# EAGLE design LED_CUBE_595 (EAGLE 7.5.0)
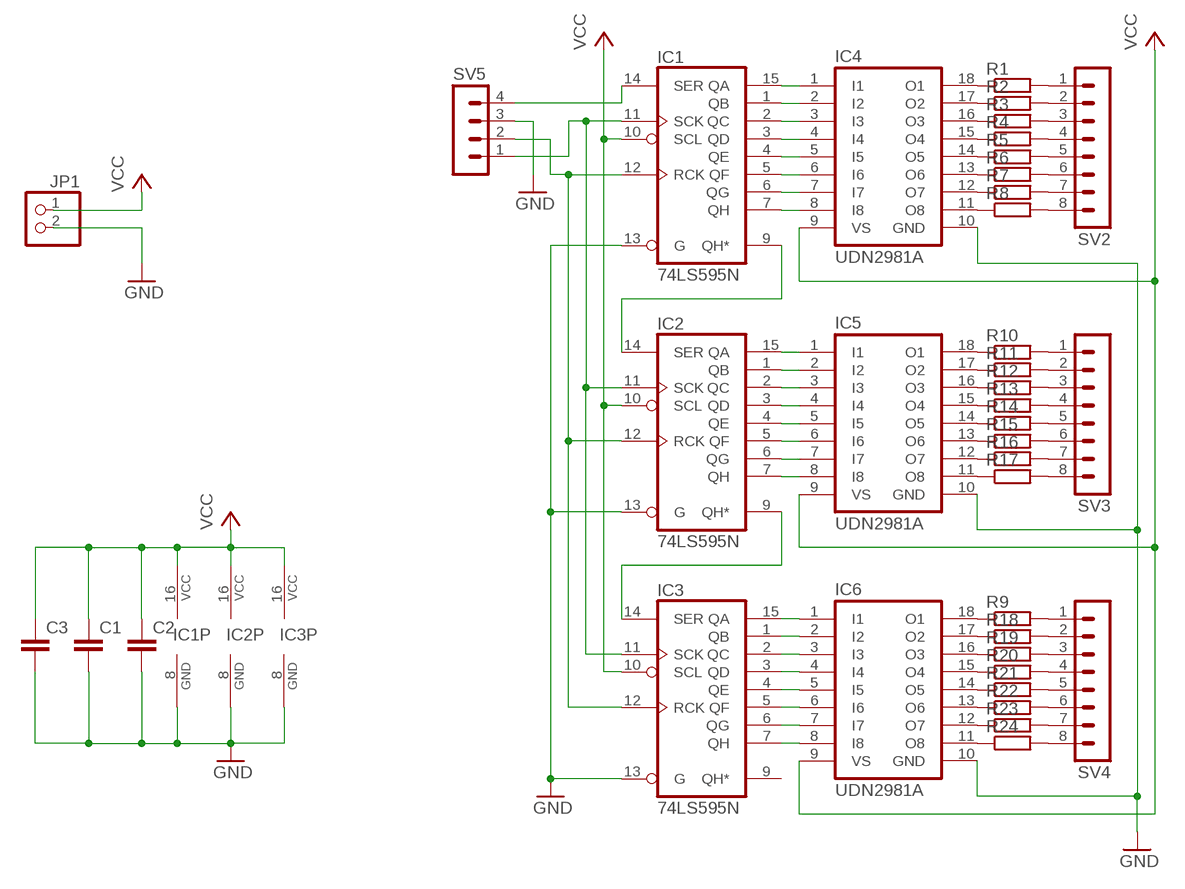
[diagram p0: schematic, sheet 1]

## Parts
C1  C-EU025-025X050  [C025-025X050]
C2  C-EU025-025X050  [C025-025X050]
C3  C-EU025-025X050  [C025-025X050]
IC1  74LS595N  [DIL16]
IC2  74LS595N  [DIL16]
IC3  74LS595N  [DIL16]
IC4  UDN2981A  [DIL18]
IC5  UDN2981A  [DIL18]
IC6  UDN2981A  [DIL18]
JP1  PINHD-1X2  [1X02]
R1  R-EU_0204/2V  [0204V]
R2  R-EU_0204/2V  [0204V]
R3  R-EU_0204/2V  [0204V]
R4  R-EU_0204/2V  [0204V]
R5  R-EU_0204/2V  [0204V]
R6  R-EU_0204/2V  [0204V]
R7  R-EU_0204/2V  [0204V]
R8  R-EU_0204/2V  [0204V]
R9  R-EU_0204/2V  [0204V]
R10  R-EU_0204/2V  [0204V]
R11  R-EU_0204/2V  [0204V]
R12  R-EU_0204/2V  [0204V]
R13  R-EU_0204/2V  [0204V]
R14  R-EU_0204/2V  [0204V]
R15  R-EU_0204/2V  [0204V]
R16  R-EU_0204/2V  [0204V]
R17  R-EU_0204/2V  [0204V]
R18  R-EU_0204/2V  [0204V]
R19  R-EU_0204/2V  [0204V]
R20  R-EU_0204/2V  [0204V]
R21  R-EU_0204/2V  [0204V]
R22  R-EU_0204/2V  [0204V]
R23  R-EU_0204/2V  [0204V]
R24  R-EU_0204/2V  [0204V]
SV2  MA08-1  [MA08-1]
SV3  MA08-1  [MA08-1]
SV4  MA08-1  [MA08-1]
SV5  MA04-1  [MA04-1]

## Nets
GND: C1.2 C2.2 C3.2 IC1.8(GND) IC1.13(G) IC2.8(GND) IC2.13(G) IC3.8(GND) IC3.13(G) IC4.10(GND) IC5.10(GND) IC6.10(GND) JP1.2 SV5.3
N$1: IC1.9(QH*) IC2.14(SER)
N$2: IC1.15(QA) IC4.1(I1)
N$3: IC1.1(QB) IC4.2(I2)
N$4: IC1.2(QC) IC4.3(I3)
N$5: IC1.3(QD) IC4.4(I4)
N$6: IC1.4(QE) IC4.5(I5)
N$7: IC1.5(QF) IC4.6(I6)
N$8: IC1.6(QG) IC4.7(I7)
N$9: IC1.7(QH) IC4.8(I8)
N$10: IC2.15(QA) IC5.1(I1)
N$11: IC2.1(QB) IC5.2(I2)
N$12: IC2.2(QC) IC5.3(I3)
N$13: IC2.3(QD) IC5.4(I4)
N$14: IC2.4(QE) IC5.5(I5)
N$15: IC2.5(QF) IC5.6(I6)
N$16: IC2.6(QG) IC5.7(I7)
N$17: IC2.7(QH) IC5.8(I8)
N$18: IC4.18(O1) R1.1
N$19: IC4.17(O2) R2.1
N$20: IC4.16(O3) R3.1
N$21: IC4.15(O4) R4.1
N$22: IC4.14(O5) R5.1
N$23: IC4.13(O6) R6.1
N$24: IC4.12(O7) R7.1
N$25: IC4.11(O8) R8.1
N$26: R1.2 SV2.1
N$27: IC1.11(SCK) IC2.11(SCK) IC3.11(SCK) SV5.1
N$28: IC1.14(SER) SV5.4
N$29: IC1.12(RCK) IC2.12(RCK) IC3.12(RCK) SV5.2
N$30: IC2.9(QH*) IC3.14(SER)
N$32: IC5.17(O2) R11.1
N$33: IC5.16(O3) R12.1
N$34: IC5.15(O4) R13.1
N$35: IC5.14(O5) R14.1
N$36: IC5.13(O6) R15.1
N$37: IC5.12(O7) R16.1
N$38: IC5.11(O8) R17.1
N$39: R2.2 SV2.2
N$40: IC5.18(O1) R10.1
N$41: R3.2 SV2.3
N$42: R4.2 SV2.4
N$43: R5.2 SV2.5
N$44: R6.2 SV2.6
N$45: R7.2 SV2.7
N$46: R8.2 SV2.8
N$47: R10.2 SV3.1
N$48: R11.2 SV3.2
N$49: R12.2 SV3.3
N$50: R13.2 SV3.4
N$51: R14.2 SV3.5
N$52: R15.2 SV3.6
N$53: R16.2 SV3.7
N$54: R17.2 SV3.8
N$55: IC6.18(O1) R9.1
N$56: IC6.17(O2) R18.1
N$57: IC6.16(O3) R19.1
N$58: IC6.15(O4) R20.1
N$59: IC6.14(O5) R21.1
N$60: IC6.13(O6) R22.1
N$61: IC6.12(O7) R23.1
N$62: IC6.11(O8) R24.1
N$63: R9.2 SV4.1
N$64: R18.2 SV4.2
N$65: R19.2 SV4.3
N$66: R20.2 SV4.4
N$67: R21.2 SV4.5
N$68: R22.2 SV4.6
N$69: R23.2 SV4.7
N$70: R24.2 SV4.8
N$73: IC3.15(QA) IC6.1(I1)
N$74: IC3.1(QB) IC6.2(I2)
N$75: IC3.2(QC) IC6.3(I3)
N$76: IC3.3(QD) IC6.4(I4)
N$77: IC3.4(QE) IC6.5(I5)
N$78: IC3.5(QF) IC6.6(I6)
N$79: IC3.6(QG) IC6.7(I7)
N$80: IC3.7(QH) IC6.8(I8)
VCC: C1.1 C2.1 C3.1 IC1.10(SCL) IC1.16(VCC) IC2.10(SCL) IC2.16(VCC) IC3.10(SCL) IC3.16(VCC) IC4.9(VS) IC5.9(VS) IC6.9(VS) JP1.1
Unconnected: IC3.9(QH*)

## Library data of the parts
C1-C3 = rcl:C-EU: CAPACITOR, European symbol
IC1-IC3 = 74xx-us:74*595: 8-bit SHIFT REGISTER, output latch
IC4-IC6 = uln-udn:UDN298*: DRIVER ARRAY Source: Allegro Microsystems Inc. / UDN2981-UDN2984.pdf
JP1 = pinhead:PINHD-1X2: PIN HEADER
R1-R24 = rcl:R-EU_: RESISTOR, European symbol
SV2-SV4 = con-lstb:MA08-1: PIN HEADER; OC_FARNELL: unknown; OC_NEWARK: unknown
SV5 = con-lstb:MA04-1: PIN HEADER; OC_FARNELL: unknown; OC_NEWARK: unknown

## Board
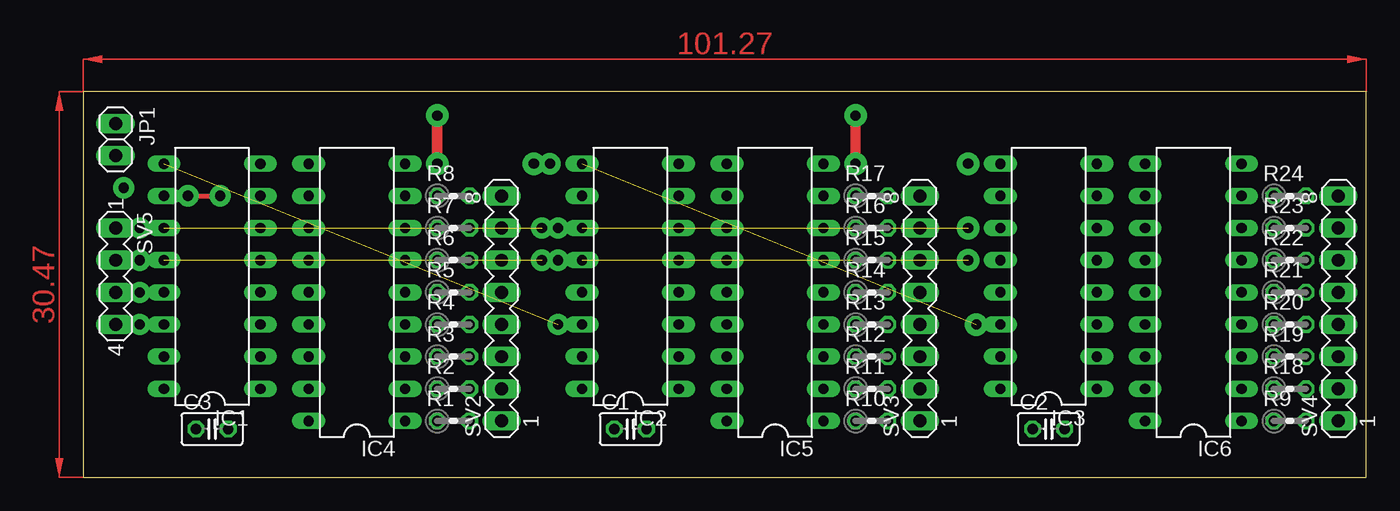
[diagram p1: board, top side]
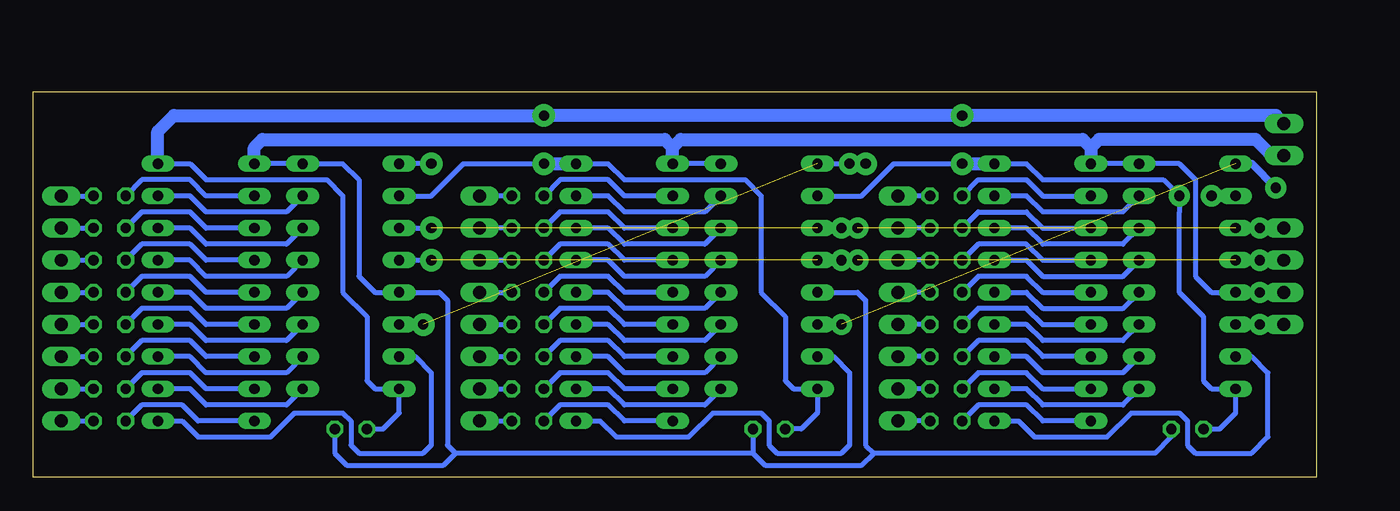
[diagram p2: board, bottom side, seen from below]

Size 101.27 x 30.47 mm. Coordinates in mm from the lower left corner, seen from the top.
Outline: 0,0 101.27,0 101.27,30.47 0,30.47 0,0
Copper layers (1*16): Top 0.035mm / dielectric 1.5mm / Bottom 0.035mm
Design rules "default": minimum track width 10mil, minimum drill 24mil, track to track 8mil, track to pad 8mil, pad to pad 8mil, via to via 8mil, smd to smd 8mil, copper to edge 40mil, drill to drill 8mil, minimum pad ring 10mil, minimum via ring 8mil, stop-mask expansion 4mil, vias tented up to drill 0mil, thermal gap 10mil

### Footprints (pad centres in the part's own frame; a part is rotated, then mirrored left to right if it is on the bottom)
C025-025X050 = drill 0.813 octagon: 1 -1.27,0; 2 1.27,0
DIL16 = drill 0.813 long: 1 -8.89,-3.81; 2 -6.35,-3.81; 3 -3.81,-3.81; 4 -1.27,-3.81; 5 1.27,-3.81; 6 3.81,-3.81; 7 6.35,-3.81; 8 8.89,-3.81; 9 8.89,3.81; 10 6.35,3.81; 11 3.81,3.81; 12 1.27,3.81; 13 -1.27,3.81; 14 -3.81,3.81; 15 -6.35,3.81; 16 -8.89,3.81
DIL18 = drill 0.813 long: 1 -10.16,-3.81; 2 -7.62,-3.81; 3 -5.08,-3.81; 4 -2.54,-3.81; 5 0,-3.81; 6 2.54,-3.81; 7 5.08,-3.81; 8 7.62,-3.81; 9 10.16,-3.81; 10 10.16,3.81; 11 7.62,3.81; 12 5.08,3.81; 13 2.54,3.81; 14 0,3.81; 15 -2.54,3.81; 16 -5.08,3.81; 17 -7.62,3.81; 18 -10.16,3.81
1X02 = drill 1.016 long: 1 -1.27,0; 2 1.27,0
0204V = drill 0.813 octagon: 1 -1.27,0; 2 1.27,0
MA08-1 = drill 1.016 long: 1 -8.89,0; 2 -6.35,0; 3 -3.81,0; 4 -1.27,0; 5 1.27,0; 6 3.81,0; 7 6.35,0; 8 8.89,0
MA04-1 = drill 1.016 long: 1 -3.81,0; 2 -1.27,0; 3 1.27,0; 4 3.81,0

### Placement (x,y rotation side)
C1  43.18,3.81 0 top
C2  76.2,3.81 0 top
C3  10.16,3.81 0 top
IC1  10.16,15.88 90 top
IC2  43.18,15.88 90 top
IC3  76.2,15.88 90 top
IC4  21.59,14.61 90 top
IC5  54.61,14.61 90 top
IC6  87.63,14.61 90 top
JP1  2.54,26.67 270 top
R1  29.21,4.45 0 top
R2  29.21,6.99 0 top
R3  29.21,9.53 0 top
R4  29.21,12.06 0 top
R5  29.21,14.61 0 top
R6  29.21,17.14 0 top
R7  29.21,19.68 0 top
R8  29.21,22.23 0 top
R9  95.25,4.45 0 top
R10  62.23,4.45 0 top
R11  62.23,6.99 0 top
R12  62.23,9.53 0 top
R13  62.23,12.06 0 top
R14  62.23,14.61 0 top
R15  62.23,17.14 0 top
R16  62.23,19.68 0 top
R17  62.23,22.23 0 top
R18  95.25,6.99 0 top
R19  95.25,9.53 0 top
R20  95.25,12.06 0 top
R21  95.25,14.61 0 top
R22  95.25,17.14 0 top
R23  95.25,19.68 0 top
R24  95.25,22.23 0 top
SV2  33.02,13.34 90 top
SV3  66.04,13.34 90 top
SV4  99.06,13.34 90 top
SV5  2.54,15.88 270 top

### Tracks (layer width: path | path; a pad name or v marks a point on that pad's centre or on a via)
GND
  Bottom 0.406: IC4.10 IC1.8 10.79,24.77 9.53,23.5 9.53,15.88 8.26,14.61 IC1.13 SV5.3 | IC2.8 IC5.10 | IC6.10 IC3.8 76.84,24.77 75.57,23.5 75.57,15.88 74.3,14.61 IC3.13 69.22,14.61 68.58,13.97 68.58,2.54 67.95,1.91 | IC2.13 36.2,14.61 35.56,13.97 35.56,2.54 34.92,1.91 | 44.45,1.91 67.95,1.91 | 34.92,1.91 12.7,1.91 11.43,3.17 C3.2 | C1.2 44.45,1.91 | C2.2 77.47,1.91 76.52,0.95 68.9,0.95 67.95,1.91 | 44.45,1.91 43.5,0.95 35.88,0.95 34.92,1.91
  Bottom 1.016: IC5.10 50.8,26.04 | 17.78,26.04 IC4.10 | 17.78,26.04 17.15,26.67 4.76,26.67 3.49,25.4 JP1.2 | 50.8,26.04 50.16,26.67 18.42,26.67 17.78,26.04 | IC6.10 83.82,26.04 83.19,26.67 51.43,26.67 50.8,26.04
N$1  (via drill 0.8 pad 1.68)  (1 unrouted)
  Bottom 0.406: IC2.14 v37.46,12.06
  Bottom 0.61: IC1.9 5.08,24.77 v3.17,22.86
  other vias: 4.45,19.68 4.45,17.14 4.45,14.61 4.45,12.06
N$2
  Bottom 0.406: IC4.1 23.5,4.45 22.23,3.17 16.51,3.17 14.61,5.08 10.79,5.08 10.16,4.45 10.16,2.54 9.53,1.91 5.08,1.91 3.81,3.17 3.81,8.26 5.08,9.53 IC1.15
N$3
  Bottom 0.406: IC1.1 15.24,5.71 21.59,5.71 22.86,6.99 IC4.2
N$4
  Bottom 0.406: IC1.2 15.24,8.26 21.59,8.26 22.86,9.53 IC4.3
N$5
  Bottom 0.406: IC1.3 15.24,10.79 21.59,10.79 22.86,12.06 IC4.4
N$6
  Bottom 0.406: IC4.5 22.86,14.61 21.59,13.34 15.24,13.34 IC1.4
N$7
  Bottom 0.406: IC4.6 22.86,17.14 21.59,15.88 15.24,15.88 IC1.5
N$8
  Bottom 0.406: IC1.6 15.24,18.41 21.59,18.41 22.86,19.68 IC4.7
N$9
  Bottom 0.406: IC1.7 15.24,20.95 21.59,20.95 22.86,22.23 IC4.8
N$10
  Bottom 0.406: IC5.1 56.52,4.45 55.24,3.17 49.53,3.17 47.62,5.08 43.81,5.08 43.18,4.45 43.18,2.54 42.54,1.91 37.46,1.91 36.83,2.54 36.83,8.26 38.1,9.53 IC2.15
N$11
  Bottom 0.406: IC2.1 48.26,5.71 54.61,5.71 55.88,6.99 IC5.2
N$12
  Bottom 0.406: IC2.2 48.26,8.26 54.61,8.26 55.88,9.53 IC5.3
N$13
  Bottom 0.406: IC2.3 48.26,10.79 54.61,10.79 55.88,12.06 IC5.4
N$14
  Bottom 0.406: IC2.4 48.26,13.34 54.61,13.34 55.88,14.61 IC5.5
N$15
  Bottom 0.406: IC2.5 48.26,15.88 54.61,15.88 55.88,17.14 IC5.6
N$16
  Bottom 0.406: IC2.6 48.26,18.41 54.61,18.41 55.88,19.68 IC5.7
N$17
  Bottom 0.406: IC2.7 48.26,20.95 54.61,20.95 55.88,22.23 IC5.8
N$18
  Bottom 0.406: IC4.18 21.59,4.45 22.86,5.71 26.67,5.71 R1.1
N$19
  Bottom 0.406: IC4.17 21.59,6.99 22.86,8.26 26.67,8.26 R2.1
N$20
  Bottom 0.406: IC4.16 21.59,9.53 22.86,10.79 26.67,10.79 R3.1
N$21
  Bottom 0.406: IC4.15 21.59,12.06 22.86,13.34 26.67,13.34 R4.1
N$22
  Bottom 0.406: IC4.14 21.59,14.61 22.86,15.88 26.67,15.88 R5.1
N$23
  Bottom 0.406: IC4.13 21.59,17.14 22.86,18.41 26.67,18.41 R6.1
N$24
  Bottom 0.406: R7.1 26.67,20.95 22.86,20.95 21.59,19.68 IC4.12
N$25
  Bottom 0.406: R8.1 26.67,23.5 22.86,23.5 21.59,22.23 IC4.11
N$26
  Bottom 0.406: R1.2 SV2.1
N$27  (via drill 0.8 pad 1.68, 0.8 pad 1.78)  (2 unrouted)
  Bottom 0.406: SV5.1 IC1.11 | IC3.11 v69.85,19.68 | IC2.11 v37.46,19.68 v36.2,19.68
N$28
  Bottom 0.406: SV5.4 IC1.14
N$29  (via drill 0.8 pad 1.68, 0.8 pad 1.78)  (2 unrouted)
  Bottom 0.406: SV5.2 IC1.12 | IC3.12 v69.85,17.14 | IC2.12 v37.46,17.14 v36.2,17.14
N$30  (via drill 0.8 pad 1.68, 0.8 pad 1.78)  (1 unrouted)
  Bottom 0.406: IC3.14 v70.48,12.06 | v36.83,24.77 IC2.9 35.56,24.77
N$31  (via drill 0.8 pad 1.78)
  other vias: 35.56,24.77
N$32
  Bottom 0.406: IC5.17 54.61,6.99 55.88,8.26 59.69,8.26 R11.1
N$33
  Bottom 0.406: IC5.16 54.61,9.53 55.88,10.79 59.69,10.79 R12.1
N$34
  Bottom 0.406: IC5.15 54.61,12.06 55.88,13.34 59.69,13.34 R13.1
N$35
  Bottom 0.406: IC5.14 54.61,14.61 55.88,15.88 59.69,15.88 R14.1
N$36
  Bottom 0.406: IC5.13 54.61,17.14 55.88,18.41 59.69,18.41 R15.1
N$37
  Bottom 0.406: IC5.12 54.61,19.68 55.88,20.95 59.69,20.95 R16.1
N$38
  Bottom 0.406: IC5.11 54.61,22.23 55.88,23.5 59.69,23.5 R17.1
N$39
  Bottom 0.406: R2.2 SV2.2
N$40
  Bottom 0.406: IC5.18 54.61,4.45 55.88,5.71 59.69,5.71 R10.1
N$41
  Bottom 0.406: R3.2 SV2.3
N$42
  Bottom 0.406: R4.2 SV2.4
N$43
  Bottom 0.406: R5.2 SV2.5
N$44
  Bottom 0.406: R6.2 SV2.6
N$45
  Bottom 0.406: R7.2 SV2.7
N$46
  Bottom 0.406: R8.2 SV2.8
N$47
  Bottom 0.406: SV3.1 R10.2
N$48
  Bottom 0.406: SV3.2 R11.2
N$49
  Bottom 0.406: SV3.3 R12.2
N$50
  Bottom 0.406: SV3.4 R13.2
N$51
  Bottom 0.406: SV3.5 R14.2
N$52
  Bottom 0.406: SV3.6 R15.2
N$53
  Bottom 0.406: R16.2 SV3.7
N$54
  Bottom 0.406: R17.2 SV3.8
N$55
  Bottom 0.406: IC6.18 88.27,4.45 89.54,5.71 92.71,5.71 R9.1
N$56
  Bottom 0.406: IC6.17 87.63,6.99 88.9,8.26 92.71,8.26 R18.1
N$57
  Bottom 0.406: IC6.16 87.63,9.53 88.9,10.79 92.71,10.79 R19.1
N$58
  Bottom 0.406: IC6.15 87.63,12.06 88.9,13.34 92.71,13.34 R20.1
N$59
  Bottom 0.406: IC6.14 87.63,14.61 88.9,15.88 92.71,15.88 R21.1
N$60
  Bottom 0.406: IC6.13 87.63,17.14 88.9,18.41 92.71,18.41 R22.1
N$61
  Bottom 0.406: IC6.12 87.63,19.68 88.9,20.95 92.71,20.95 R23.1
N$62
  Bottom 0.406: IC6.11 87.63,22.23 88.9,23.5 92.71,23.5 R24.1
N$63
  Bottom 0.406: SV4.1 R9.2
N$64
  Bottom 0.406: SV4.2 R18.2
N$65
  Bottom 0.406: SV4.3 R19.2
N$66
  Bottom 0.406: SV4.4 R20.2
N$67
  Bottom 0.406: SV4.5 R21.2
N$68
  Bottom 0.406: SV4.6 R22.2
N$69
  Bottom 0.406: SV4.7 R23.2
N$70
  Bottom 0.406: SV4.8 R24.2
N$71  (via drill 0.8 pad 1.78)
  Bottom 0.406: v69.85,24.77 72.39,24.77
N$73
  Bottom 0.406: IC6.1 89.54,4.45 88.27,3.17 82.55,3.17 80.65,5.08 76.84,5.08 76.2,4.45 76.2,2.54 75.57,1.91 70.48,1.91 69.85,2.54 69.85,8.26 71.12,9.53 IC3.15
N$74
  Bottom 0.406: IC3.1 81.28,5.71 87.63,5.71 88.9,6.99 IC6.2
N$75
  Bottom 0.406: IC3.2 81.28,8.26 87.63,8.26 88.9,9.53 IC6.3
N$76
  Bottom 0.406: IC3.3 81.28,10.79 87.63,10.79 88.9,12.06 IC6.4
N$77
  Bottom 0.406: IC3.4 81.28,13.34 87.63,13.34 88.9,14.61 IC6.5
N$78
  Bottom 0.406: IC3.5 81.28,15.88 87.63,15.88 88.9,17.14 IC6.6
N$79
  Bottom 0.406: IC3.6 81.28,18.41 87.63,18.41 88.9,19.68 IC6.7
N$80
  Bottom 0.406: IC3.7 81.28,20.95 87.63,20.95 88.9,22.23 IC6.8
VCC  (via drill 0.8 pad 1.68, 0.8 pad 1.78)
  Top 0.406: v8.26,22.23 v10.79,22.23
  Top 0.813: v60.96,24.77 v60.96,28.57 | v27.94,24.77 v27.94,28.57
  Bottom 0.406: IC5.9 55.88,24.77 54.61,23.5 45.09,23.5 43.81,22.23 43.81,14.61 41.91,12.7 41.91,7.62 41.27,6.99 IC2.16 39.37,5.08 40.64,3.81 C1.1 | IC4.9 22.86,24.77 21.59,23.5 12.06,23.5 v10.79,22.23 10.79,20.95 10.79,14.61 8.89,12.7 8.89,7.62 8.26,6.99 IC1.16 6.35,5.08 7.62,3.81 C3.1 | IC6.9 88.9,24.77 87.63,23.5 78.11,23.5 76.84,22.23 76.84,14.61 74.93,12.7 74.93,7.62 74.3,6.99 IC3.16 72.39,5.08 73.66,3.81 C2.1 | IC3.10 69.85,22.23 67.31,24.77 v60.96,24.77 | IC2.10 35.88,22.23 33.34,24.77 v27.94,24.77 | IC1.10 v8.26,22.23
  Bottom 1.016: IC6.9 91.44,27.3 90.17,28.57 v60.96,28.57 v27.94,28.57 3.17,28.57 JP1.1 | v60.96,24.77 IC5.9 | v27.94,24.77 IC4.9
(copper drawn outside any net)
  shapes: Top area x2